# Altium schematic sheet CSensor.SchDoc
size 50 x 50 mm
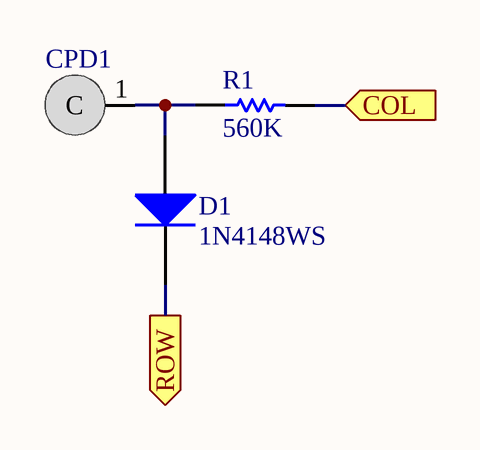
[diagram p0: CSensor.SchDoc]

## Parts
CPD1  CPAD  [CPAD]  (value not drawn)
D1  1N4148WS  [DIOD-SOD123-2_V]
R1  560K  [RESC1608X55X30NL15T15]

## Ports
COL (in), ROW (out)

## Nets
COL: R1.2 ; port COL
ROW: D1.2(K) ; port ROW
NetCPD1_1: CPD1.1 D1.1(A) R1.1

## Notes on the sheet
- (in symbol CPAD) C

## Library data of the parts
D1 = CMP-2000-04932-2: Fast Switching Diode, 100 V, 0.15 A, -65 to 150 degC, 2-Pin?SOD123, RoHS, Tape and Reel; Recovery Time: 4ns; Brand: DiodesIncorporated; Unit Weight: 0.000353oz; Max Surge Current: 2A; Peak Reverse Voltage: 100V; Ir - Reverse Current: 1uA; Vf - Forward Voltage: 1.25V; Configuration: Single; If - Forward Current: 0.15A; Product Category: Diodes-GeneralPurpose,Power,Switching; Operating Temperature Range: -65Cto+150C; Packaging: Reel; Manufacturer URL: http://www.diodes.com/; Maximum Operating Temperature: +150C; Height: 1.25mm; Minimum Operating Temperature: -65C; Product: SwitchingDiodes; Package URL: http://www.diodes.com/datasheets/ds18004.pdf; Type: SwitchingDiode; Package Reference: SOD123-2; Width: 1.7mm; Datasheet URL: http://www.farnell.com/datasheets/1915529.pdf; Datasheet Version: Rev. 24-2, 10/2013; Series: 1N4148; Factory Pack Quantity: 3000; Length: 2.85mm; RoHS: True; Manufacturer: DiodesIncorporated; Mounting Style: SMD/SMT; Package / Case: SOD-123
R1 = CMP-2000-00567-1: Manufacturer: Panasonic; Part Number: ERJ3EKF5603V